# Altium schematic sheet 07_V5_PWM_IO.SchDoc
size A4
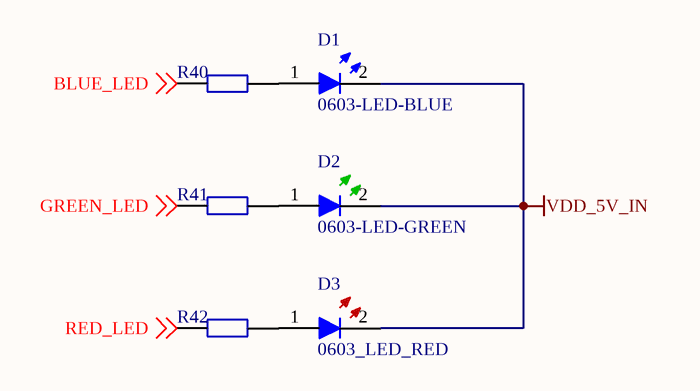
[diagram p0: 07_V5_PWM_IO.SchDoc]

## Parts
D1  0603-LED-BLUE  [0603-LED-blue]
D2  0603-LED-GREEN  [0603-LED-Green]
D3  0603_LED_RED  [0603-LED-RED]
R40  1K  [0402R]  (value not drawn)
R41  1K  [0402R]  (value not drawn)
R42  1K  [0402R]  (value not drawn)

## Nets
VDD_5V_IN: D1.2 D2.2 D3.2
BLUE_LED: R40.1 ; off-sheet BLUE_LED
GREEN_LED: R41.1 ; off-sheet GREEN_LED
RED_LED: R42.1 ; off-sheet RED_LED
NetD1_1: D1.1 R40.2
NetD2_1: D2.1 R41.2
NetD3_1: D3.1 R42.2

## Library data of the parts
R40-R42 = 0402R100R: 0402R100R 1%